# Altium schematic sheet HV_Module.schdoc: HV_Module v1.0
size 420 x 297 mm; EDA_Number: ARTIQ; Projet: HV_Module; Author: G.Kasprowicz; CompanyName: WUT ISE; DrawnBy: G.Kasprowicz; Organization: WUT ISE; Address1: PW ISE; Address2: Nowowiejska 15/19 00-665 Warsaw; Address3: gkasprow@gmail.com; DocumentNumber: 1; Revision: 1.0; SheetNumber: 1; SheetTotal: 11; ModifiedBy: -; CheckedDate: -; Title2: Top; DivGrp: WUT ISE; Designer: G.Kasprowicz; ModifiedDate: -; ProjectName: Sensor Box
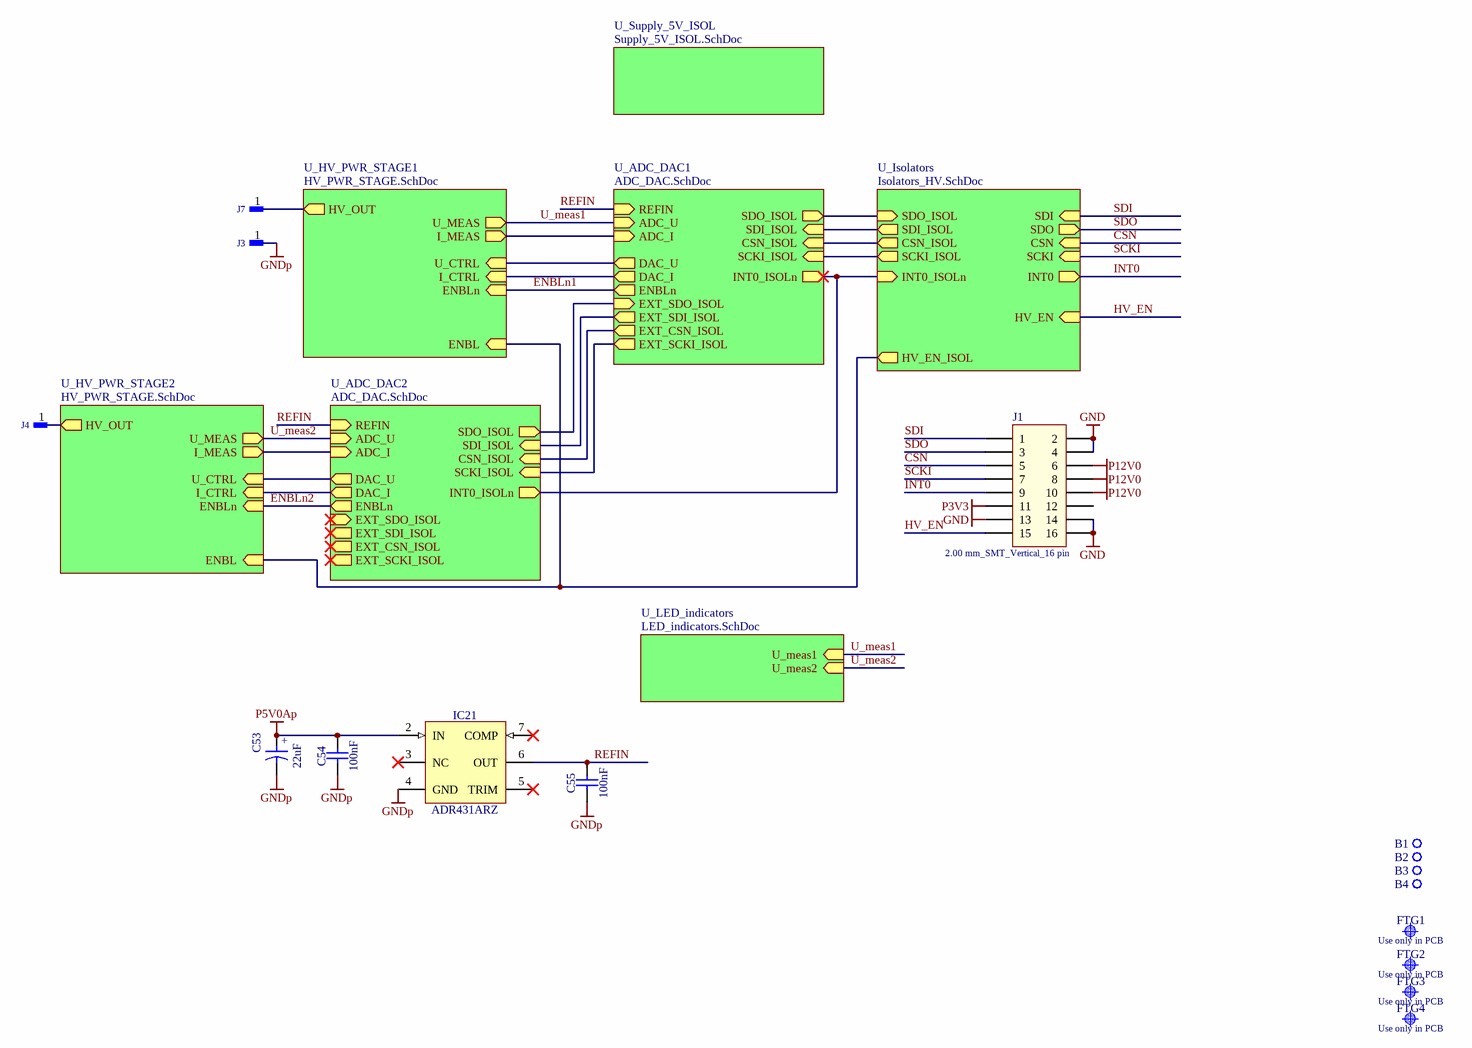
[diagram p0: HV_Module.schdoc]

## Parts
B1  Plated Hole  [MTG270_500]  (value not drawn)  (no BOM)
B2  Plated Hole  [MTG270_500]  (value not drawn)  (no BOM)
B3  Plated Hole  [MTG270_500]  (value not drawn)  (no BOM)
B4  Plated Hole  [MTG270_500]  (value not drawn)  (no BOM)
C53  22uF  [CAPMP3528X210N]
C54  100nF  [CAPC1005X55N]
C55  100nF  [CAPC1005X55N]
FTG1  Use only in PCB  [FIDUCIAL_TOP_C100-200]  (no BOM)
FTG2  Use only in PCB  [FIDUCIAL_TOP_S100-200]  (no BOM)
FTG3  Use only in PCB  [FIDUCIAL_TOP_S100-200]  (no BOM)
FTG4  Use only in PCB  [FIDUCIAL_TOP_S100-200]  (no BOM)
IC21  ADR431ARZ  [SOIC127P600X175-8N]
J1  2.00 mm_SMT_Vertical_16 pin  [62131621821]
J3  SMD Pad  [R400X300]  (value not drawn)
J4  SMD Pad  [R400X300]  (value not drawn)
J7  SMD Pad  [R400X300]  (value not drawn)

## Sub-sheets
U_ADC_DAC1 = ADC_DAC.SchDoc: SDO_ISOL (out), SDI_ISOL (in), CSN_ISOL (in), SCKI_ISOL (in), INT0_ISOLn (out), ADC_U (in), ADC_I (in), DAC_U (out), DAC_I (out), EXT_SDO_ISOL (in), EXT_SDI_ISOL (out), EXT_CSN_ISOL (out), REFIN (in), EXT_SCKI_ISOL (out), ENBLn (out)
U_ADC_DAC2 = ADC_DAC.SchDoc: SDO_ISOL (out), SDI_ISOL (in), CSN_ISOL (in), SCKI_ISOL (in), INT0_ISOLn (out), ADC_U (in), ADC_I (in), DAC_U (out), DAC_I (out), EXT_SDO_ISOL (in), EXT_SDI_ISOL (out), EXT_CSN_ISOL (out), REFIN (in), EXT_SCKI_ISOL (out), ENBLn (out)
U_HV_PWR_STAGE1 = HV_PWR_STAGE.SchDoc: U_CTRL (in), I_MEAS (out), U_MEAS (out), HV_OUT (out), I_CTRL (in), ENBLn (in), ENBL (in)
U_HV_PWR_STAGE2 = HV_PWR_STAGE.SchDoc: U_CTRL (in), I_MEAS (out), U_MEAS (out), HV_OUT (out), I_CTRL (in), ENBLn (in), ENBL (in)
U_Isolators = Isolators_HV.SchDoc: SDI (in), SDO (out), CSN (in), SCKI (in), INT0 (out), HV_EN (in), SDI_ISOL (out), CSN_ISOL (out), HV_EN_ISOL (out), INT0_ISOLn (in), SCKI_ISOL (out), SDO_ISOL (in)
U_LED_indicators = LED_indicators.SchDoc: U_meas1 (in), U_meas2 (in)
U_Supply_5V_ISOL = Supply_5V_ISOL.SchDoc: no entries

## Nets
GND: J1.2 J1.4 J1.13 J1.14 J1.16
GNDp: C53.2 C54.1 C55.1 IC21.4(GND) J3.1
P3V3: J1.11
P5V0Ap: C53.1 C54.2 IC21.2(IN)
P12V0: J1.6 J1.8 J1.10
CSN: J1.5 ; sheet U_Isolators/CSN
ENBLn1: sheet U_ADC_DAC1/ENBLn, sheet U_HV_PWR_STAGE1/ENBLn
ENBLn2: sheet U_ADC_DAC2/ENBLn, sheet U_HV_PWR_STAGE2/ENBLn
HV_EN: J1.15 ; sheet U_Isolators/HV_EN
INT0: J1.9 ; sheet U_Isolators/INT0
REFIN: C55.2 IC21.6(OUT) ; sheet U_ADC_DAC1/REFIN, sheet U_ADC_DAC2/REFIN
SCKI: J1.7 ; sheet U_Isolators/SCKI
SDI: J1.1 ; sheet U_Isolators/SDI
SDO: J1.3 ; sheet U_Isolators/SDO
U_meas1: sheet U_ADC_DAC1/ADC_U, sheet U_HV_PWR_STAGE1/U_MEAS, sheet U_LED_indicators/U_meas1
U_meas2: sheet U_ADC_DAC2/ADC_U, sheet U_HV_PWR_STAGE2/U_MEAS, sheet U_LED_indicators/U_meas2
NetJ4_1: J4.1 ; sheet U_HV_PWR_STAGE2/HV_OUT
NetJ7_1: J7.1 ; sheet U_HV_PWR_STAGE1/HV_OUT
(unnamed): sheet U_Isolators/SDI_ISOL, sheet U_ADC_DAC1/SDI_ISOL
(unnamed): sheet U_Isolators/CSN_ISOL, sheet U_ADC_DAC1/CSN_ISOL
(unnamed): sheet U_Isolators/HV_EN_ISOL, sheet U_HV_PWR_STAGE1/ENBL, sheet U_HV_PWR_STAGE2/ENBL
(unnamed): sheet U_Isolators/INT0_ISOLn, sheet U_ADC_DAC1/INT0_ISOLn, sheet U_ADC_DAC2/INT0_ISOLn
(unnamed): sheet U_Isolators/SCKI_ISOL, sheet U_ADC_DAC1/SCKI_ISOL
(unnamed): sheet U_Isolators/SDO_ISOL, sheet U_ADC_DAC1/SDO_ISOL
(unnamed): sheet U_ADC_DAC1/ADC_I, sheet U_HV_PWR_STAGE1/I_MEAS
(unnamed): sheet U_ADC_DAC1/DAC_U, sheet U_HV_PWR_STAGE1/U_CTRL
(unnamed): sheet U_ADC_DAC1/DAC_I, sheet U_HV_PWR_STAGE1/I_CTRL
(unnamed): sheet U_ADC_DAC1/EXT_SDO_ISOL, sheet U_ADC_DAC2/SDO_ISOL
(unnamed): sheet U_ADC_DAC1/EXT_SDI_ISOL, sheet U_ADC_DAC2/SDI_ISOL
(unnamed): sheet U_ADC_DAC1/EXT_CSN_ISOL, sheet U_ADC_DAC2/CSN_ISOL
(unnamed): sheet U_ADC_DAC1/EXT_SCKI_ISOL, sheet U_ADC_DAC2/SCKI_ISOL
(unnamed): sheet U_ADC_DAC2/ADC_I, sheet U_HV_PWR_STAGE2/I_MEAS
(unnamed): sheet U_ADC_DAC2/DAC_U, sheet U_HV_PWR_STAGE2/U_CTRL
(unnamed): sheet U_ADC_DAC2/DAC_I, sheet U_HV_PWR_STAGE2/I_CTRL

Not connected (* = marked no-connect by the designer): B1 1; B2 1; B3 1; B4 1; IC21 3(NC)* 5(TRIM)* 7(COMP)*; J1 12

## Notes on the sheet
- Project/Equipment
- Document
- Designer
- Drawn by
- Check.by
- Copyright WUT ISE 2018.
  This documentation describes Open Hardware and is licensed under the CERN OHL v.1.1. You may redistribute and modify this documentation under the terms of the CERN OHL v.1.1. (http://ohwr.org/CERNOHL). This documentation is distributed WITHOUT ANY EXPRESS OR IMPLIED WARRANTY, INCLUDING OF MERCHANTABILITY, SATISFACTORY QUALITY AND FITNESS FOR A PARTICULAR PURPOSE. Please see the CERN OHL v.1.1 for applicable conditions.
- Contact
- File
- Last Mod.
- Print Date
- Sheet
- Size
- A3
- of
- Rev
- (in symbol CTE3528-21_22UF_20V_10%) +

## Library data of the parts
B1-B4 = PLATED_HOLE2.7_PAD5.0: Single Terminal Socket; Part Description: Plated Through Hole: Hole Dia.=2.7mm Pad Dia.=5.0mm; Mounted: No; Part Number: PLATED_HOLE2.7_PAD5.0; Component Type: Standard (No BOM); Pin Count: 1; Family: Plated Hole; Socket: No; SMD: No; Sense: No; Status: None; ComponentHeight: 0mm; HelpURL: Undefined; Author: CERN DEM JMW; CreateDate: 27.09.2011; LatestRevisionDate: 27.09.2011; PackageDescription: Plated Through Hole: Hole Dia.=2.7mm Pad Dia.=5.0mm
C53 = CTE3528-21_22UF_20V_10%: Polarised capacitor; Part Description: Solid Tantalum Chip Capacitor; Manufacturer: GENERIC; Manufacturer1 Part Number: TAJB226K020R; Voltage: 20V; Tolerance: ±10%; Part Number: CTE3528-21_22UF_20V_10%; Component Kind: Standard; Component Type: Standard; Pin Count: 2; Value: 22uF; Status: Preferred; Manufacturer Part Number: CTE3528-21_22UF_20V_10%; Case: B; Mounted: Yes; Socket: No; SMD: Yes; Sense: No; Manufacturer1 Example: AVX; Manufacturer1 ComponentHeight: 2.1mm; HelpURL: \\cern.ch\dfs\Applications\Altium\Datasheets\CTE_AVX_TAJ.pdf; Author: CERN DEM JLC; CreateDate: 03/12/2007; LatestRevisionDate: 03/12/2007
C54 C55 = CC0402_100NF_16V_10%_X7R: Non-polarised capacitor; Part Description: SMD Multilayer Chip Ceramic Capacitor; Manufacturer: GENERIC; Manufacturer1 Part Number: GRM155R71C104KA88D; Voltage: 16V; TC: X7R; Tolerance: ±10%; Part Number: CC0402_100NF_16V_10%_X7R; Component Kind: Standard; Component Type: Standard; Pin Count: 2; Value: 100nF; Status: Not Recommended; Manufacturer Part Number: CC0402_100NF_16V_10%_X7R; Case: 0402; Mounted: Yes; Socket: No; SMD: Yes; Sense: No; Manufacturer1 Example: MURATA; Manufacturer1 ComponentHeight: 0.55mm; HelpURL: \\cern.ch\dfs\Applications\Altium\Datasheets\CC0402_X7R_MURATA_GRM.pdf; Author: CERN DEM JLC; CreateDate: 05.12.2013; LatestRevisionDate: 03.12.2007
FTG1 = FIDUCIAL_TARGET_C100-200: Fiducial Target; Part Description: Round Fiducial Target, Top Layer, 1.0mm, Top Solder 2.0mm, Keepout =2.0mm; Mounted: No; Part Number: FIDUCIAL_TARGET_C100-200; Component Type: Standard (No BOM); Pin Count: 1; Family: Fiducial; Socket: No; SMD: Yes; Sense: No; Status: None; ComponentHeight: 0mm; HelpURL: Undefined; Author: CERN DEM JLC; CreateDate: 09.02.2010; LatestRevisionDate: 04.04.2012; PackageDescription: Round Fiducial Target, Top Layer, 1.0mm, Top Solder 2.0mm, Keepout =2.0mm
FTG2-FTG4 = FIDUCIAL_TARGET_S100-200: Fiducial Target; Part Description: Square Fiducial Target, Top Layer, 1.0mm, Top Solder 2.0mm, Keepout =2.0mm; Mounted: No; Part Number: FIDUCIAL_TARGET_S100-200; Component Type: Standard (No BOM); Pin Count: 1; Family: Fiducial; Socket: No; SMD: Yes; Sense: No; Status: None; ComponentHeight: 0mm; HelpURL: Undefined; Author: CERN DEM JLC; CreateDate: 09.02.2010; LatestRevisionDate: 04.04.2012; PackageDescription: Square Fiducial Target, Top Layer, 1.0mm, Top Solder 2.0mm, Keepout =2.0mm
IC21 = ADR431ARZ: 2.5V ±0.12% 10ppm/°C Ultralow Noise XFET Voltage References with Current Sink and Source Capability; Part Description: 2.5V Output,  3mV ±0.12% Accuracy, 10ppm/°C Ultralow Noise XFET Voltage References with Current Sink and Source Capability; Manufacturer: ANALOG DEVICES; PressFit: No; Bonding: No; Part Number: ADR431ARZ; Component Kind: Standard; Component Type: Standard; Device: ADR431ARZ; PackageDescription: SOIC 8, Pitch 1.27mm, Body 4x5mm, IPC Medium Density; Manufacturer Part Number: ADR431ARZ; Pin Count: 6; Case: SOIC8; Mounted: Yes; Socket: No; SMD: Yes; Sense: No; ComponentHeight: 1.75mm; HelpURL: \\cern.ch\dfs\Applications\Altium\Datasheets\ADR431ARZ.pdf; Author: CERN DEM JLC; CreateDate: 26.08.2013; LatestRevisionDate: 26.08.2013
J1 = 62131621821: Socket Header WR-PHD, Pitch 2.00 mm, SMT, Vertical, dual row, 16 pin; Rated Current: 2 A; Pin Number: 16; Pitch: 2.00 mm; Working Voltage: 200 VAC; Contact Resistance: 20 mOhm; Insulation Resistance: >1000 MOhm; ComponentLink1Description: Manufacturer; ComponentLink1URL: http://www.we-online.de; ComponentLink2Description: Datasheet; ComponentLink2URL: http://katalog.we-online.com/em/datasheet/62131621821.pdf; Part Number: 62131621821; Published Date: Jan. 2018; Publisher: Wurth Elektronik; Operating Temperature: -40 to 105 degC; Mounting Technology: SMT; Row Number: dual; Orientation: Vertical
J3 J4 J7 = SMD_PAD_4X3MM: Single SMD Pad; Part Description: 4mm x 3mm SMD Pad; Mounted: No; Part Number: SMD_PAD_4X3MM; Component Kind: Standard (No BOM); Component Type: Standard (No BOM); Pin Count: 1; Family: SMD Pad; Socket: No; SMD: No; Sense: No; Status: None; ComponentHeight: 0mm; HelpURL: Undefined; Author: CERN DEM JLC; CreateDate: 15.03.2010; LatestRevisionDate: 15.03.2010; PackageDescription: 4mm x  3mm SMD Pad